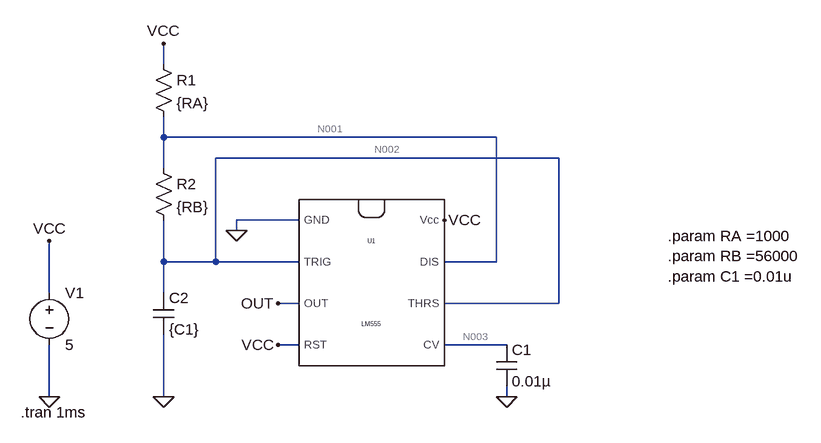
[diagram p0: schematic Draft1.asc]
Draft1.asc, the LTspice schematic file:
Version 4
SHEET 1 900 680
WIRE -112 -160 -112 -192
WIRE -112 -48 -112 -80
WIRE 400 -48 -112 -48
WIRE 496 -16 -32 -16
WIRE -112 0 -112 -48
WIRE 96 80 0 80
WIRE 0 96 0 80
WIRE -112 144 -112 80
WIRE -32 144 -32 -16
WIRE -32 144 -112 144
WIRE 96 144 -32 144
WIRE 400 144 400 -48
WIRE 400 144 320 144
WIRE -288 192 -288 112
WIRE -112 192 -112 144
WIRE 96 208 64 208
WIRE 496 208 496 -16
WIRE 496 208 320 208
WIRE 96 272 64 272
WIRE 416 272 320 272
WIRE -288 352 -288 272
WIRE -112 352 -112 256
WIRE 416 352 416 336
FLAG 0 96 0
FLAG 416 352 0
FLAG -112 352 0
FLAG -112 -192 VCC
FLAG 320 80 VCC
FLAG -288 112 VCC
FLAG -288 352 0
FLAG 64 208 OUT
FLAG 64 272 VCC
SYMBOL LM555 208 176 R0
SYMATTR InstName U1
SYMBOL cap 400 272 R0
SYMATTR InstName C1
SYMATTR Value 0.01µ
SYMBOL cap -128 192 R0
SYMATTR InstName C2
SYMATTR Value {C1}
SYMBOL res -128 -16 R0
SYMATTR InstName R2
SYMATTR Value {RB}
SYMBOL res -128 -176 R0
SYMATTR InstName R1
SYMATTR Value {RA}
SYMBOL voltage -288 176 R0
SYMATTR InstName V1
SYMATTR Value 5
TEXT 664 104 Left 2 !.param RA =1000\n.param RB =56000\n.param C1 =0.01u
TEXT -332 376 Left 2 !.tran 1ms

The netlist it stands for:
* Draft1.asc
XU1 0 N002 OUT VCC N003 N002 N001 VCC NE555  ; pins GND TRIG OUT RST CV THRS DIS Vcc
C1 N003 0 0.01µ
C2 N002 0 {C1}
R2 N001 N002 {RB}
R1 VCC N001 {RA}
V1 VCC 0 5
.param RA =1000
.param RB =56000
.param C1 =0.01u
.tran 1ms
.lib NE555.sub
.backanno
.end

* Results of the author's LTspice run, read from the files saved beside the schematic
* Operating Point, zero values left out:
*   V(n002) = 4.999 V
*   V(n003) = 3.333 V
*   V(vcc) = 5 V
*   V(n001) = 5 V
*   V(out) = 5 V
*   I(R1) = 16.67 nA
*   I(R2) = 9.999 nA
*   I(V1) = -1.611 mA
*   Ix(u1:1) = -1.611 mA
*   Ix(u1:2) = 4.999 nA
*   Ix(u1:4) = 22.67 µA
*   Ix(u1:6) = 4.999 nA
*   Ix(u1:7) = 6.672 nA
*   Ix(u1:8) = 1.588 mA
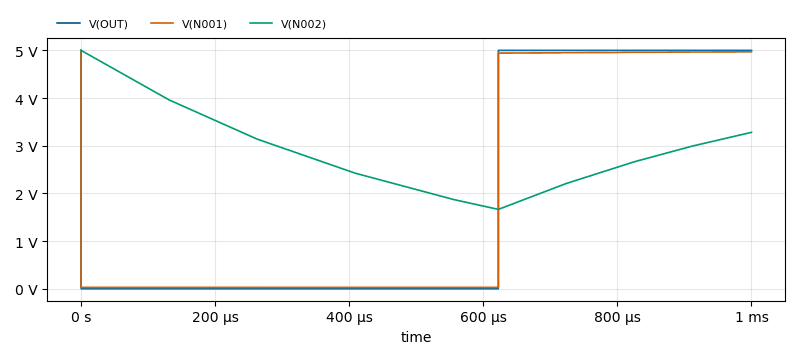
[diagram p1: Transient Analysis of Draft1.asc, plotted from the saved traces]
* Transient Analysis, 1 run:
*   V(OUT): min 30 µV, max 5 V, average 1.888 V, rms 3.072 V, last 5 V
*   V(N001): min 30 mV, max 5 V, average 1.891 V, rms 3.046 V, last 4.97 V
*   V(N002): min 1.665 V, max 4.999 V, average 2.86 V, rms 2.993 V, last 3.28 V